# Altium schematic sheet Memory.SchDoc
size A4; DocumentNumber: 6; SheetNumber: 6; SheetTotal: 6
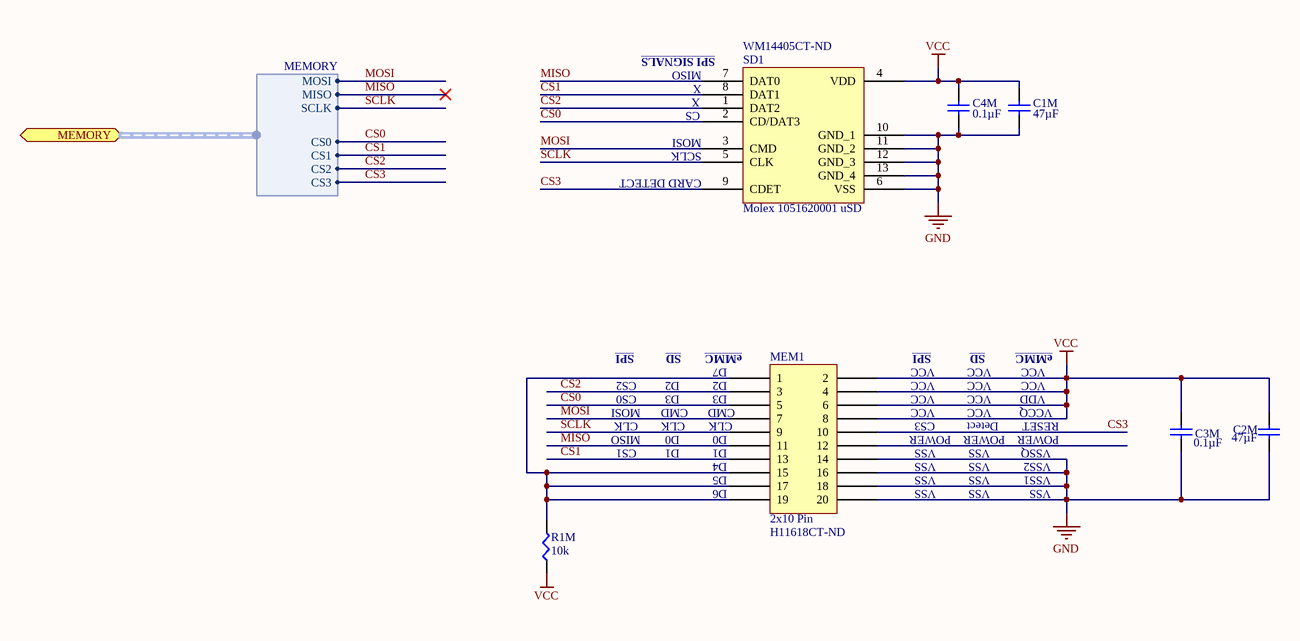
[diagram p0: Memory.SchDoc]

## Parts
C1M  Capacitance: 47µF  [C0805N]  (hidden comment: GRM21BR61A476ME15L)
C2M  Capacitance: 47µF  [C0805N]  (hidden comment: GRM21BR61A476ME15L)
C3M  Capacitance: 0.1µF  [C0603N]  (hidden comment: GCM188R71C104KA37D)
C4M  Capacitance: 0.1µF  [C0603N]  (hidden comment: GCM188R71C104KA37D)
MEM1  2x10 Pin  Supplier Part Number 1: H11618CT-ND  [HIROSE DF40C-20DP-N]
R1M  value 10k  [SMD-0603-RES]  (hidden comment: ERJ-3EKF1002V)
SD1  Molex 1051620001 uSD  Supplier Part Number 1: WM14405CT-ND  [Molex 1051620001]

## Ports
MEMORY (harness MEMORY)

## Harnesses
MEMORY: CS0, CS1, CS2, CS3, MISO, MOSI, SCLK

## Nets
GND: C1M.1 C2M.1 C3M.1 C4M.1 MEM1.14 MEM1.16 MEM1.18 MEM1.20 SD1.6(VSS) SD1.10(GND_1) SD1.11(GND_2) SD1.12(GND_3) SD1.13(GND_4)
VCC: C1M.2 C2M.2 C3M.2 C4M.2 MEM1.2 MEM1.4 MEM1.6 MEM1.8 R1M.1 SD1.4(VDD)
CS0: MEM1.5 SD1.2(CD/DAT3) ; port MEMORY.CS0
CS1: MEM1.13 SD1.8(DAT1) ; port MEMORY.CS1
CS2: MEM1.3 SD1.1(DAT2) ; port MEMORY.CS2
CS3: MEM1.10 SD1.9(CDET) ; port MEMORY.CS3
MISO: MEM1.11 SD1.7(DAT0) ; port MEMORY.MISO
MOSI: MEM1.7 SD1.3(CMD) ; port MEMORY.MOSI
SCLK: MEM1.9 SD1.5(CLK) ; port MEMORY.SCLK
NetMEM1_1: MEM1.1 MEM1.15 MEM1.17 MEM1.19 R1M.2

Not connected (* = marked no-connect by the designer): MEM1 12

## Notes on the sheet
- (near SD1) X
- (near SD1) CS
- (near SD1) MISO
- (near SD1) SPI SIGNALS
- (near SD1) MOSI
- (near SD1) SCLK
- (near SD1) CARD DETECT
- SPI
- CS2
- D2
- SD
- (near MEM1) D2
- (near MEM1) D7
- (near MEM1) eMMC
- VCC
- eMMC
- CS0
- CS1
- CLK
- MOSI
- MISO
- D3
- D0
- D1
- CMD
- (near MEM1) D3
- (near MEM1) D0
- (near MEM1) D1
- (near MEM1) CLK
- (near MEM1) CMD
- CS3
- VSS
- POWER
- Detect
- VDD
- VSSQ
- VCCQ
- RESET
- (near MEM1) D4
- (near MEM1) D5
- (near MEM1) D6
- VSS2
- VSS1

## Library data of the parts
C1M C2M = CAPACITOR_NP: 47µF 10V Ceramic Capacitor X5R 0805; HOUSEPART: NO; POPULATE: 1; TOLERANCE: ±20%; VOLTAGE: 6.3V; DeviceName: GRM21BR61A476ME15L; LibraryName: MF_Passives; DeviceSetName: CAPACITOR_NP; MPN: GRM21BR61A476ME15L; URL: https://octopart.com/cl21a476mqclrnc-samsung-24871259; MF_PARTNUM: GRM21BR61A476ME15L; Temperature Coefficient: X5R; Supplier 1: Digi-Key; Supplier Part Number 1: 490-9961-1-ND
C3M C4M = CAPACITOR_NP: HOUSEPART: NO; POPULATE: 1; TOLERANCE: ±10%; VOLTAGE: 16V; Temperature Coefficient: X7R; DeviceName: GCM188R71C104KA37D; LibraryName: MF_Passives; DeviceSetName: CAPACITOR_NP; MPN: GCM188R71C104KA37D; MF_PARTNUM: GCM188R71C104KA37D; Supplier 1: Digi-Key; Supplier Part Number 1: 490-4774-1-ND
MEM1 = 2x10 Pin: CONN HDR 20POS; Supplier 1: Digi-Key
R1M = ERJ-3EKF1002V: RES SMD 10K OHM 1% 1/10W 0603; Manufacturer: Panasonic Electronic Components; Factory Stock: 0; Unit Price (USD): 0.00379; @ qty: 1500; Minimum Quantity: 1; Power (Watts): 0.1W, 1/10W; Temperature Coefficient: ±100ppm/°C; Part Number: ERJ-3EKF1002V; Datasheets: http://industrial.panasonic.com/www-cgi/jvcr13pz.cgi?E+PZ+3+AOA0002+ERJ3EKF1002V+7+WW; Image: //media.digikey.com/Photos/Panasonic%20Photos/MFG_ERJ-P6W%20Series.jpg; Digi-Key Part Number: P10.0KHCT-ND; Quantity Available: 6703141; Packaging: Cut Tape (CT); Series: ERJ; Part Status: Active; Tolerance: ±1%; Composition: Thick Film; Features: Automotive AEC-Q200; Operating Temperature: -55°C ~ 155°C; Package / Case: 0603 (1608 Metric); Supplier Device Package: 0603; Size / Dimension: 0.063" L x 0.031" W (1.60mm x 0.80mm); Height - Seated (Max): 0.022" (0.55mm); Number of Terminations: 2; Failure Rate: -; Supplier 1: Digi-Key; Supplier Part Number 1: P10.0KHCT-ND
SD1 = Molex 1051620001 uSD: 1.45H MICRO SD HEADER WITH D/C P; Supplier 1: Digi-Key